# EasyEDA Pro project thedeck.epro

# Schematic FocusLight
Board Name: FocusLight; Create Date: 2026-03-29; Page Name: Sheet_1; Project Name: focusbox; Schematic Name: FocusLight; Update Date: 2026-04-11; Add into BOM: yes; Company: Akshat Sharma; Convert to PCB: yes; Date: 2026-03-27; REV: 1.0; Sheet: 1/1; spicePre: .
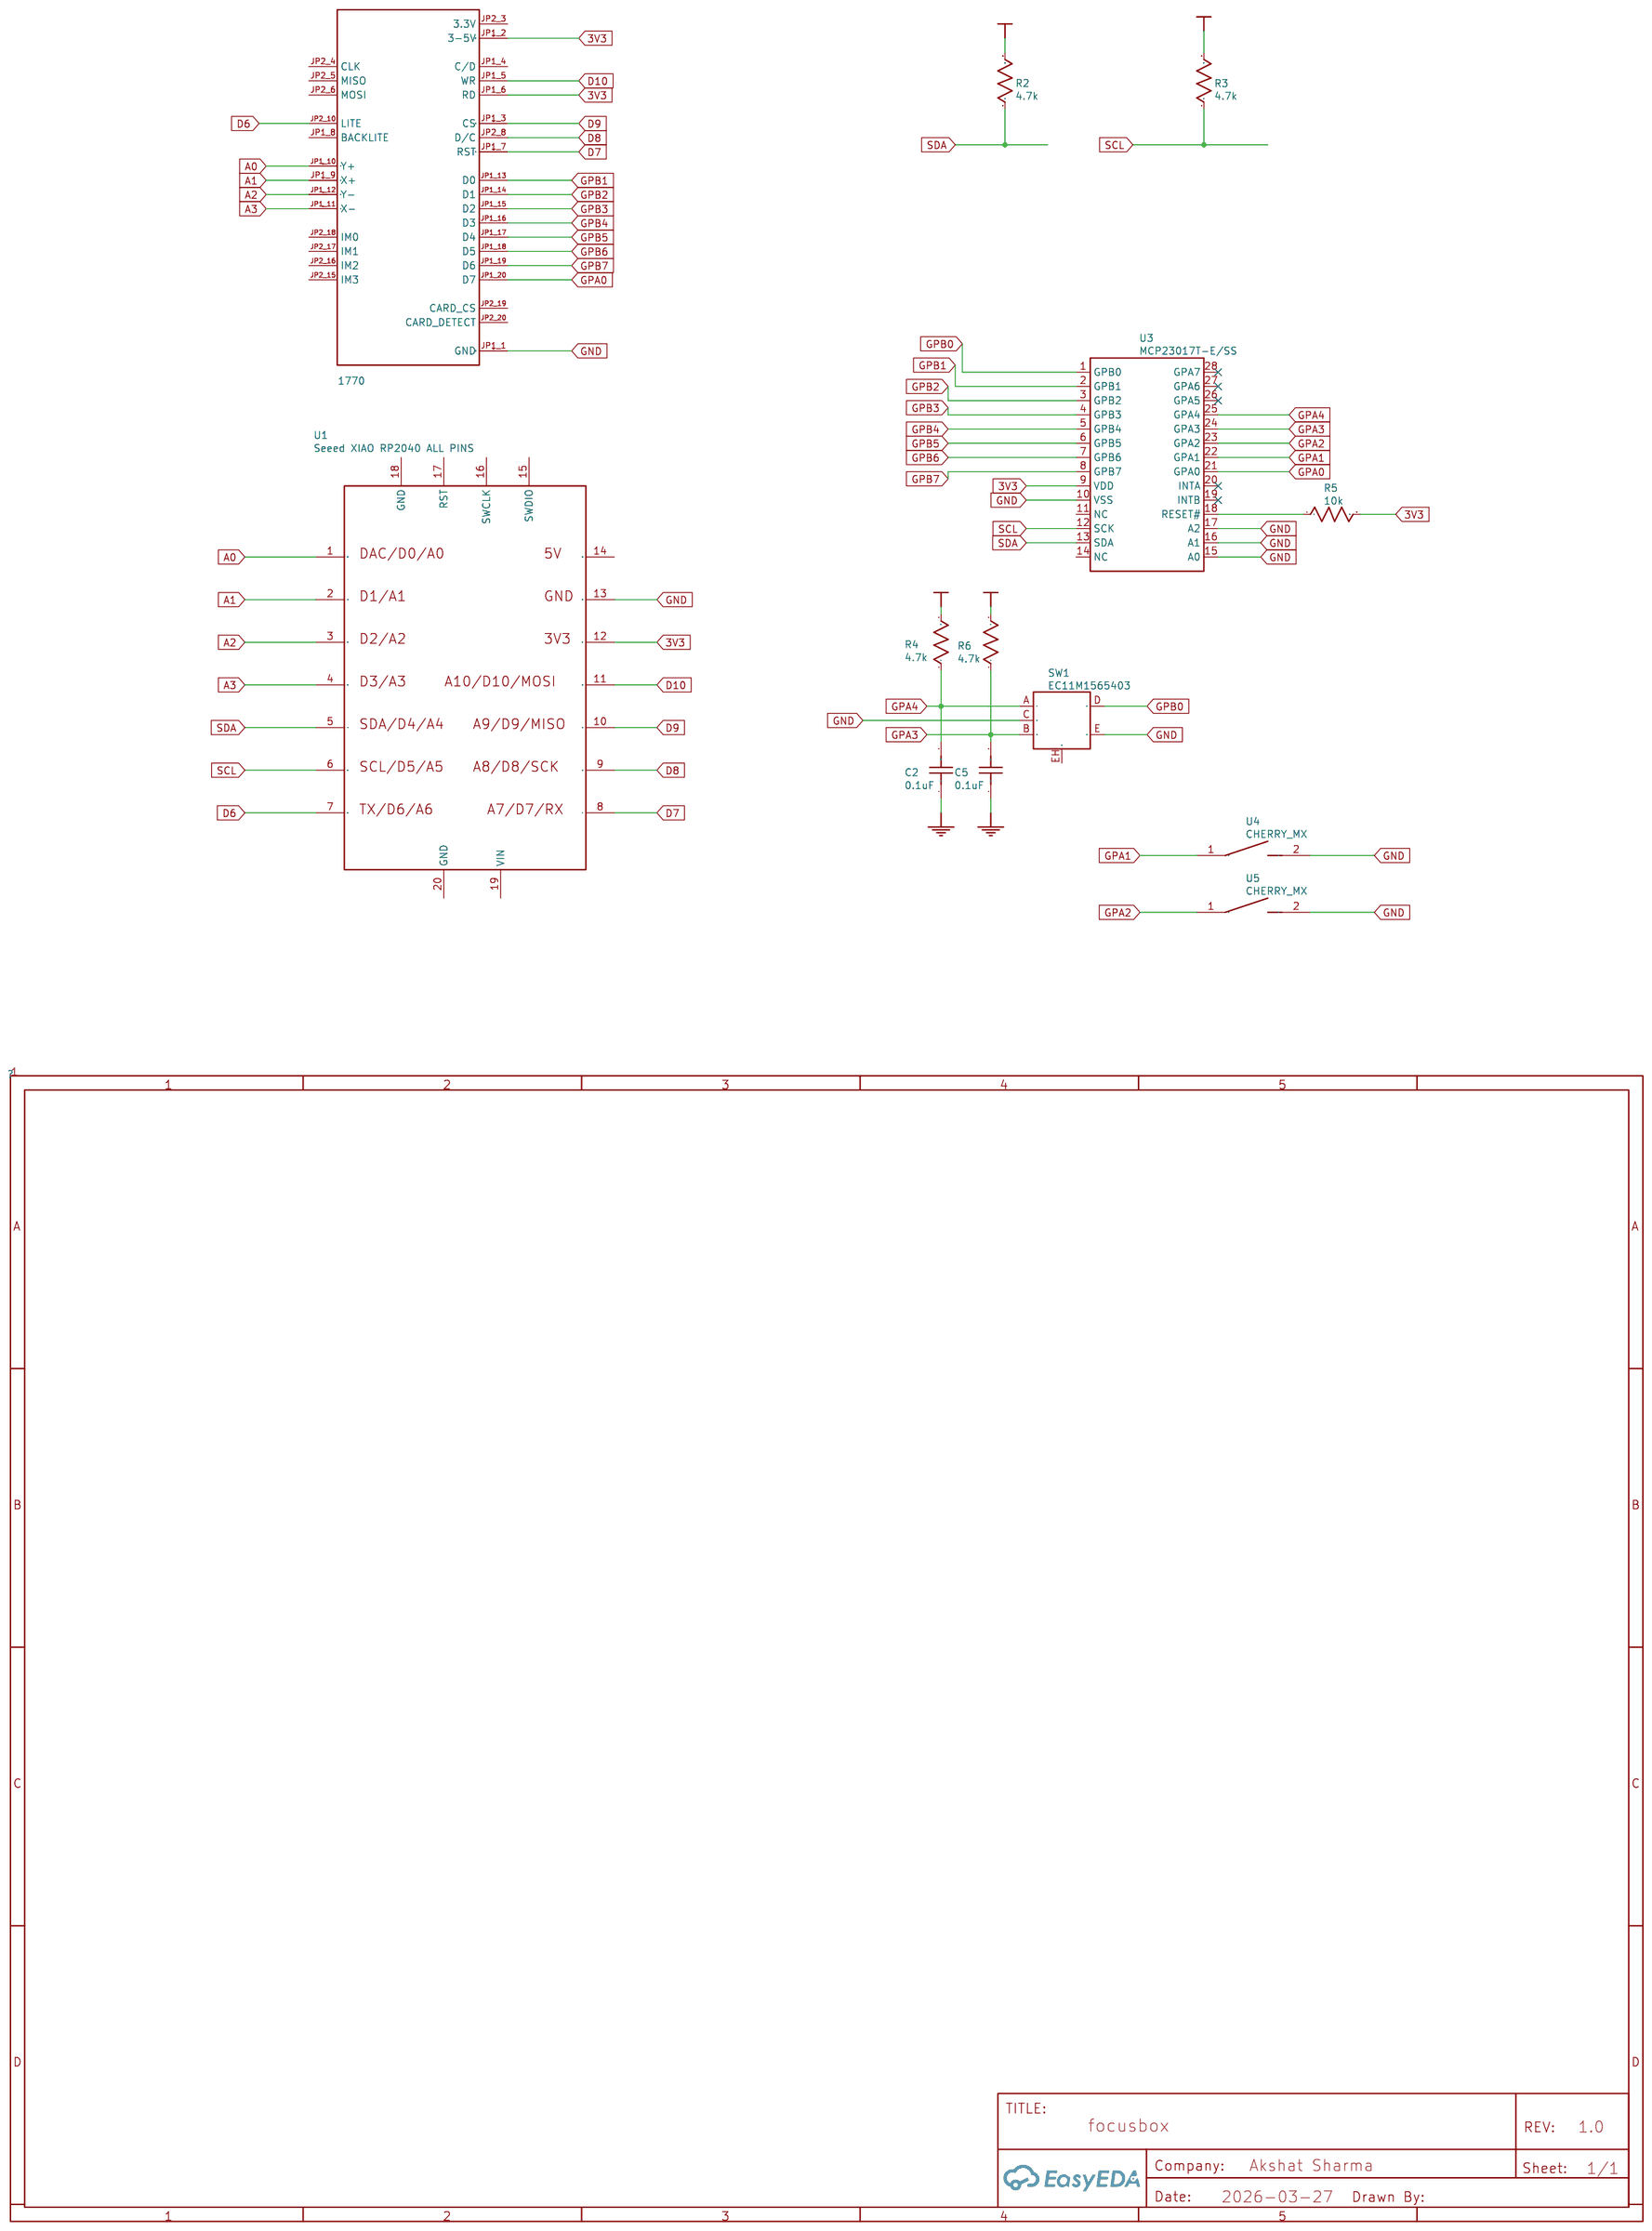
[diagram p0: schematic sheet]

## Parts
C2  0.1uF  [C0603]
C5  0.1uF  [C0603]
R2  4.7k  [R0603]
R3  4.7k  [R0603]
R4  4.7k  [R0603]
R5  10k  [R0603]
R6  4.7k  [R0603]
SW1  EC11M1565403  [SW-TH_EC11M1565403]
U1  Seeed XIAO RP2040 ALL PINS  [SEEED XIAO RP2040]
U3  MCP23017T-E/SS  [SSOP-28_L10.2-W5.3-P0.65-LS7.8-BL]
U4  CHERRY_MX  [CHERRY MX]
U5  CHERRY_MX  [CHERRY MX]
U7  1770  [MODULE_1770]

## Library data of the parts
C2 C5 = 0.1uF: nameAlias: Value(F); Contributor: LCEDA_Lib; spicePre: C; spiceSymbolName: C_0603_US
R2-R4 R6 = 4.7k: nameAlias: Value(Ω); Contributor: LCEDA_Lib; spicePre: R; spiceSymbolName: R_0603_US
R5 = 10k: nameAlias: Value(Ω); Contributor: LCEDA_Lib; spicePre: R; spiceSymbolName: R_0603_US
SW1 = EC11M1565403: Supplier: LCSC; Supplier Part: C470745; Manufacturer: ALPSALPINE(阿尔卑斯阿尔派); JLCPCB Part Class: Extended Part; Contributor: LCSC; spicePre: S
U1 = Seeed XIAO RP2040 ALL PINS: Manufacturer: Seeedstudio; Manufacturer Part: 102010328; link: https://www.seeedstudio.com/Seeeduino-XIAO-Arduino-Microcontroller-SAMD21-Cortex-M0+-p-4426.html; Contributor: Derick2k; spicePre: U
U3 = MCP23017T-E/SS: Supplier: LCSC; Supplier Part: C558584; Manufacturer: MICROCHIP(美国微芯); JLCPCB Part Class: Extended Part; Contributor: lcsc; spicePre: U
U4 U5 = CHERRY_MX: Manufacturer Part: CHERRY; Supplier: Reichelt; Contributor: drummdan; spicePre: U
U7 = 1770

## Nets
3V3: R2.2 R3.2 R4.2 R5.2 R6.2 U1.12(11) U3.9(VDD) U7.JP1_2(3-5V) U7.JP1_6(RD) U7.JP2_2(3-5V)
GND: C2.1 C5.1 SW1.C SW1.E U1.13(12) U3.10(VSS) U3.15(A0) U3.16(A1) U3.17(A2) U4.2 U5.2 U7.JP1_1(GND) U7.JP2_1(GND)
A0: U1.1(0) U7.JP1_10(Y+) U7.JP2_11(Y+)
A1: U1.2(1) U7.JP1_9(X+) U7.JP2_12(X+)
A2: U1.3(2) U7.JP1_12(Y-) U7.JP2_13(Y-)
A3: U1.4(3) U7.JP1_11(X-) U7.JP2_14(X-)
D6: U1.7(6) U7.JP2_10(LITE)
D7: U1.8(7) U7.JP1_7(RST) U7.JP2_9(RST)
D8: U1.9(8) U7.JP2_8(D/C)
D9: U1.10(9) U7.JP1_3(CS) U7.JP2_7(CS)
D10: U1.11(10) U7.JP1_5(WR)
GPA0: U3.21(GPA0) U7.JP1_20(D7)
GPA1: U3.22(GPA1) U4.1
GPA2: U3.23(GPA2) U5.1
GPA3: C5.2 R6.1 SW1.B U3.24(GPA3)
GPA4: C2.2 R4.1 SW1.A U3.25(GPA4)
GPB0: SW1.D U3.1(GPB0)
GPB1: U3.2(GPB1) U7.JP1_13(D0)
GPB2: U3.3(GPB2) U7.JP1_14(D1)
GPB3: U3.4(GPB3) U7.JP1_15(D2)
GPB4: U3.5(GPB4) U7.JP1_16(D3)
GPB5: U3.6(GPB5) U7.JP1_17(D4)
GPB6: U3.7(GPB6) U7.JP1_18(D5)
GPB7: U3.8(GPB7) U7.JP1_19(D6)
SCL: R3.1 U1.6(5) U3.12(SCK)
SDA: R2.1 U1.5(4) U3.13(SDA)
$1N56: R5.1 U3.18(RESET#)

Not connected (* = marked no-connect by the designer): SW1 EH; U1 14(13) 15(SWDIO) 16(SWCLK) 17(RST) 18(GND) 19(VIN) 20(GND); U3 11(NC) 14(NC) 19(INTB)* 20(INTA)* 26(GPA5)* 27(GPA6)* 28(GPA7)*; U7 JP1_4(C/D) JP1_8(BACKLITE) JP2_3(3.3V) JP2_4(CLK) JP2_5(MISO) JP2_6(MOSI) JP2_15(IM3) JP2_16(IM2) JP2_17(IM1) JP2_18(IM0) JP2_19(CARD_CS) JP2_20(CARD_DETECT)

# Board PCB_PCB_FocusLight_2026-03-29
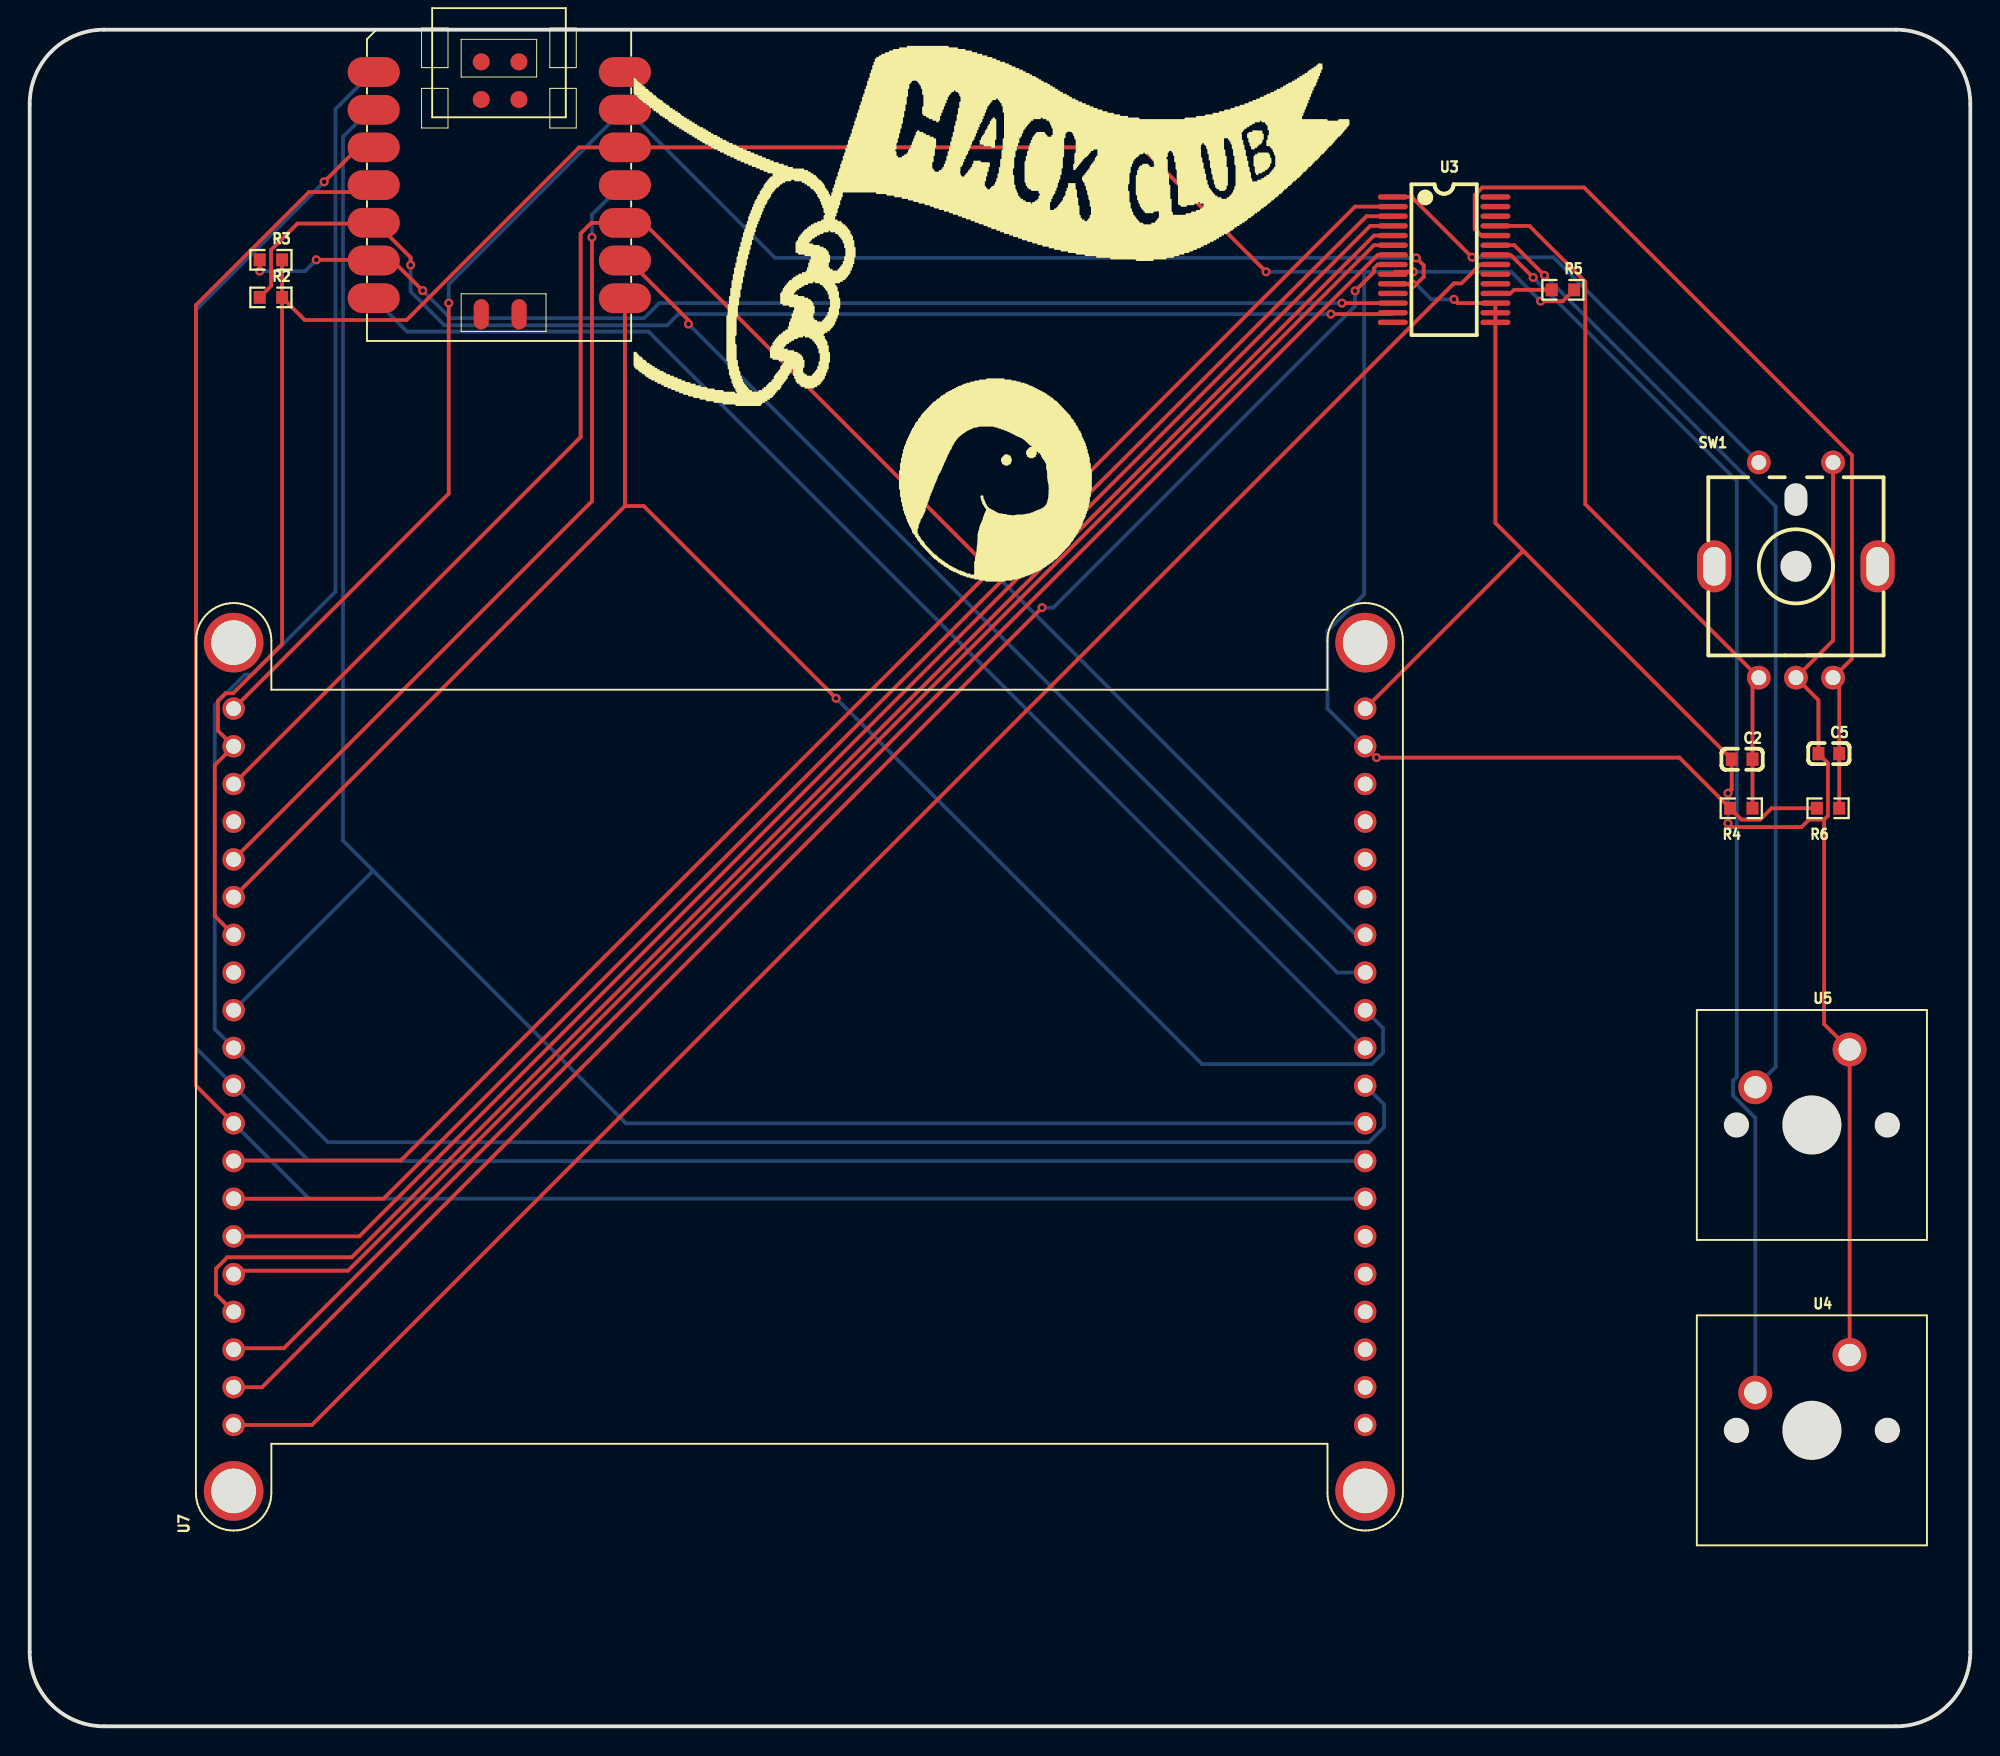
[diagram p1: board, top side]
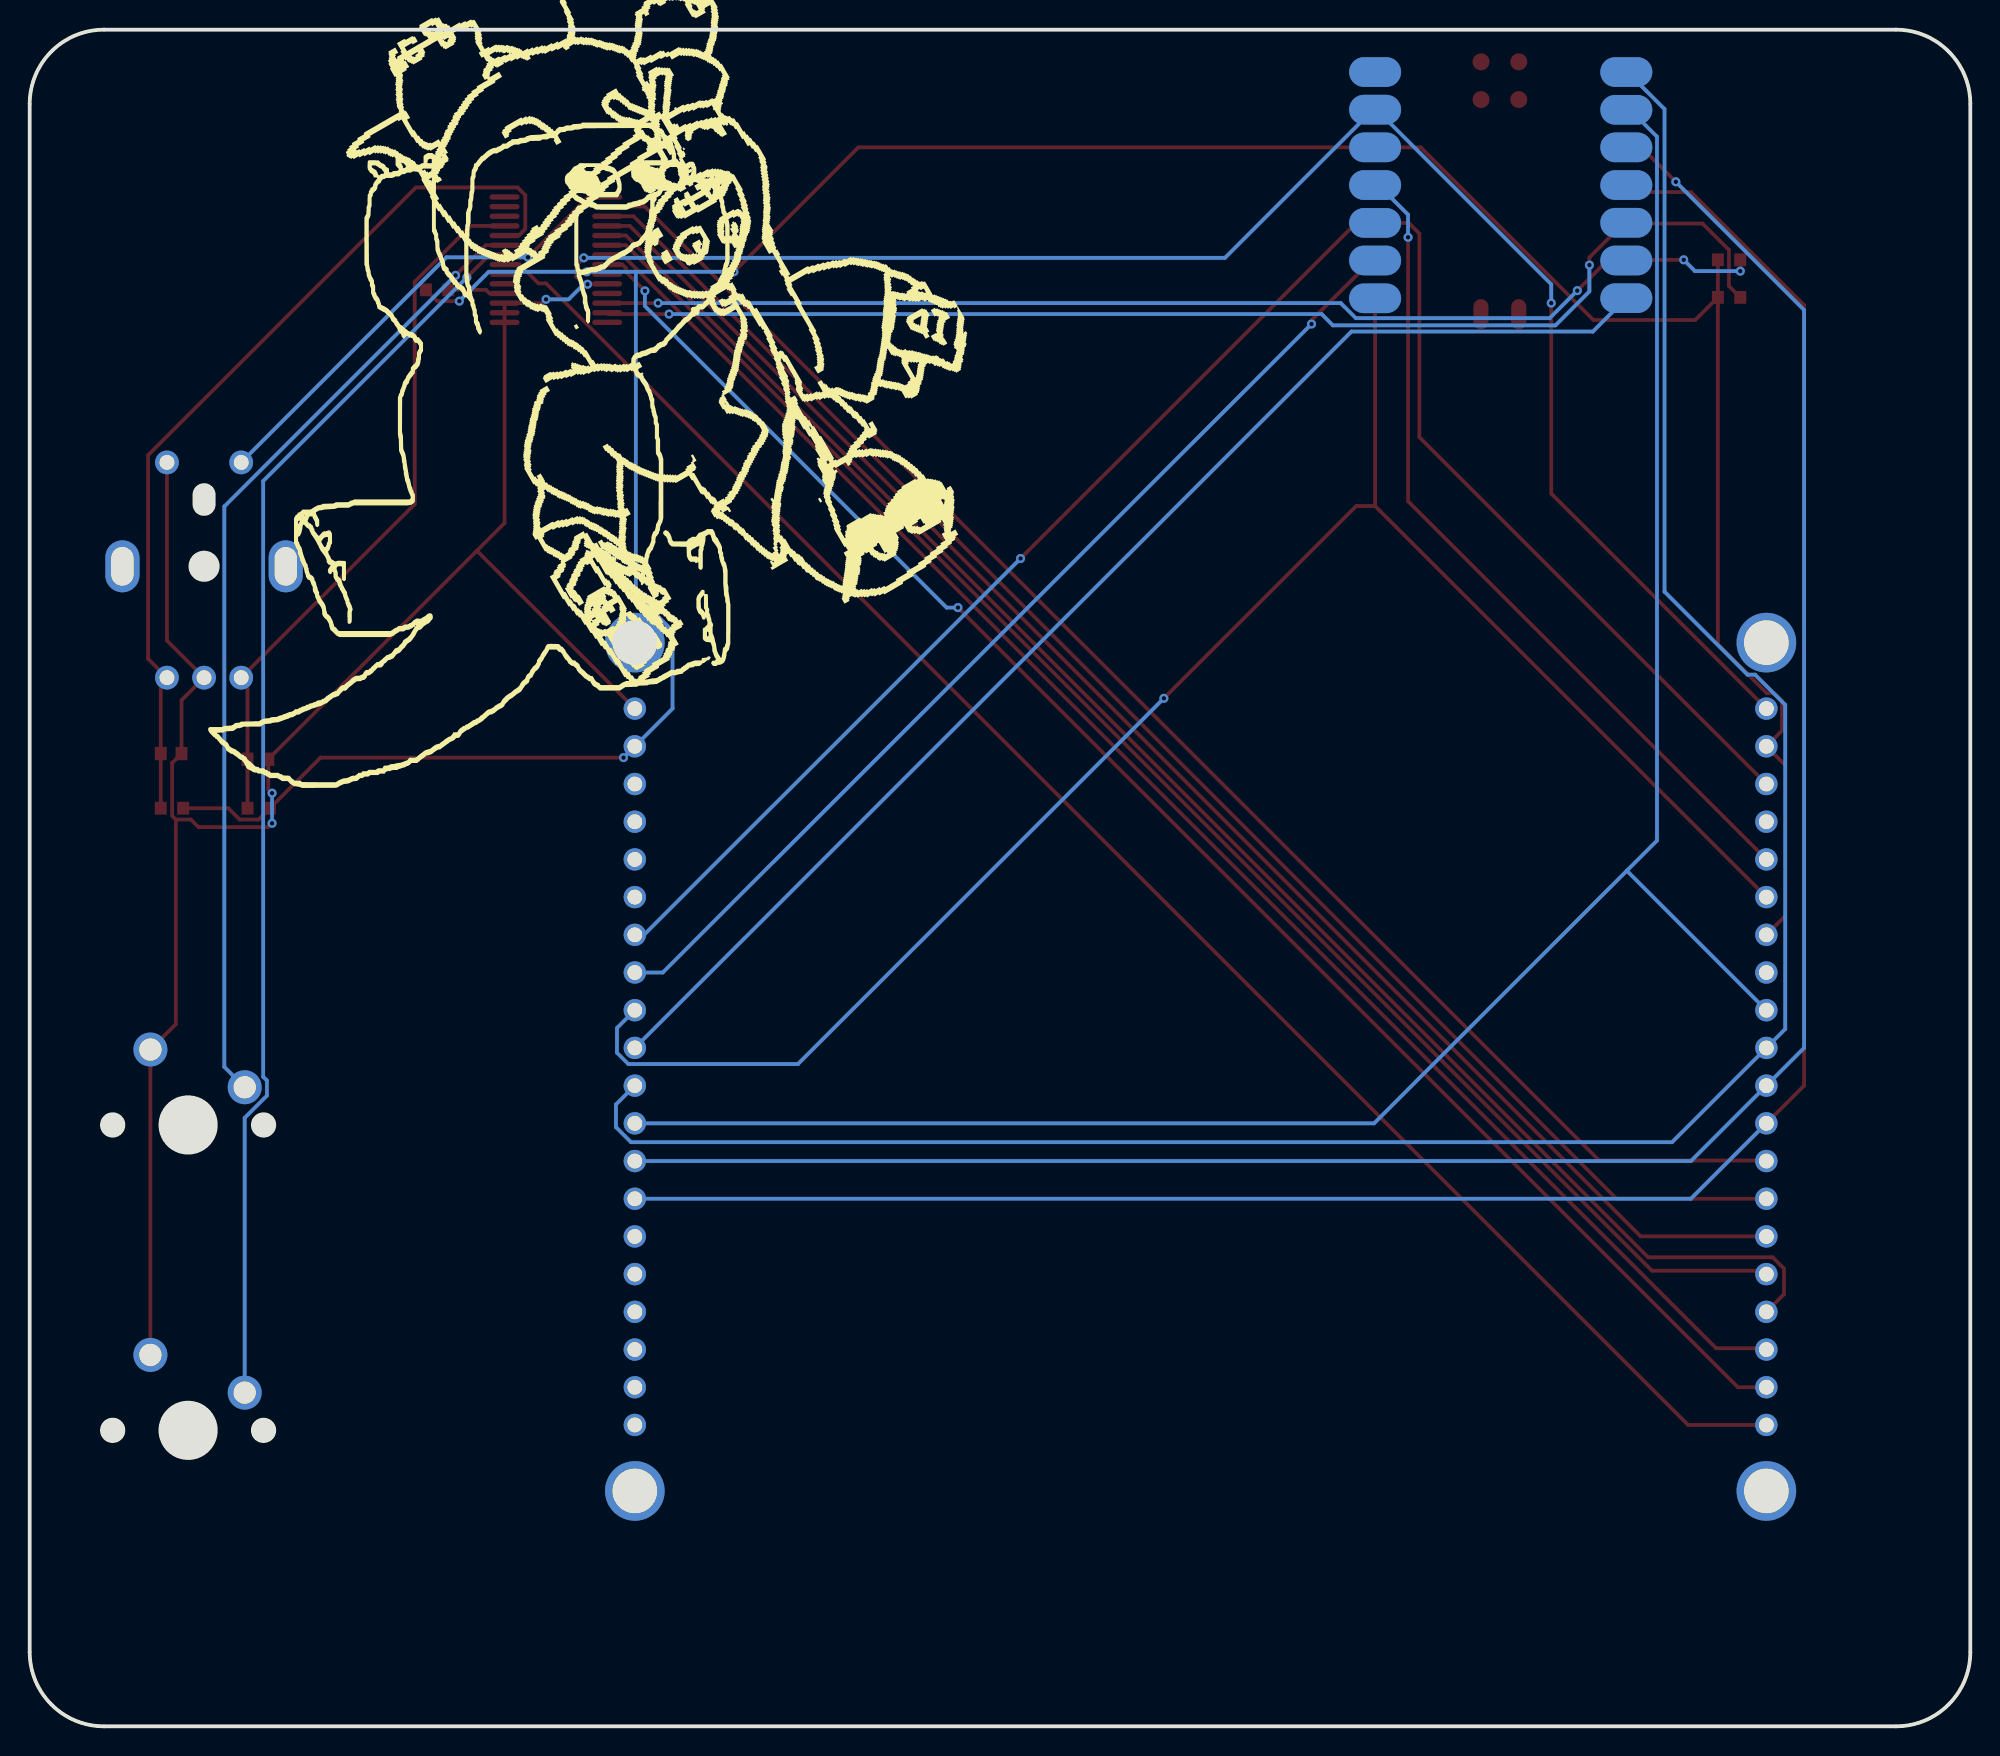
[diagram p2: board, bottom side, seen from below]

Outline 130.68 x 114.3 mm; copper layers: Top Layer, Bottom Layer. Coordinates in mm from the lower left corner of the outline.
Outline path: 0,109.3 arc(1.46,112.84) 5,114.3 125.68,114.3 arc(129.22,112.84) 130.68,109.3 130.68,5 arc(129.22,1.46) 125.68,0 5,0 arc(1.46,1.46) 0,5 0,109.3
Stack: Top Layer 0.035mm / Dielectric1 1.51mm FR4 er 4.5 / Bottom Layer 0.035mm

## Design rules (mm)
template: User Custom Config
spacing Default (default): track to track 0.152, other pairs 0 to 0.152
track width Default (default): min 0.254, default 0.254, max 25.4
differential pair differentialPair (default): width min 0.127, default 0.254, max 2.54; gap min 0.152, default 0.152
via Default (default): diameter min 0.61, default 0.61, max 100.025; hole min 0.305, default 0.305, max 59.995

## Placement (name value [footprint] x y rotation side)
C2  0.1uF  [C0603]  115.32 65.15 0 top
C5  0.1uF  [C0603]  121.16 65.53 0 top
R2  4.7k  [R0603]  16.24 96.27 0 top
R3  4.7k  [R0603]  16.24 98.8 0 top
R4  4.7k  [R0603]  115.26 61.85 180 top
R5  10k  [R0603]  103.25 96.77 0 top
R6  4.7k  [R0603]  121.1 61.85 180 top
SW1  EC11M1565403  [SW-TH_EC11M1565403]  118.94 77.9 0 top
U1  Seeed XIAO RP2040 ALL PINS  [SEEED XIAO RP2040]  31.62 103.63 0 top
U3  MCP23017T-E/SS  [SSOP-28_L10.2-W5.3-P0.65-LS7.8-BL]  95.25 98.81 270 top
U4  CHERRY_MX  [CHERRY MX]  120.02 19.94 0 top
U5  CHERRY_MX  [CHERRY MX]  120.02 40.51 0 top
U7  1770  [MODULE_1770]  51.83 44.43 90 top

## Footprints (pads in the part's own frame, mm; a bottom-side part is the same pattern mirrored in y, then rotated)
C0603
  rect 0.8x0.9 smd: 1(-0.7,0) 2(0.7,0)
CHERRY MX
  round 2.286 hole 1.498: 1(-3.81,2.54) 2(2.54,5.08)
MODULE_1770
  round 1.508 hole 1: JP1_1(24.13,38.1) JP1_2(21.59,38.1) JP1_3(19.05,38.1) JP1_4(16.51,38.1) JP1_5(13.97,38.1) JP1_6(8.89,38.1) JP1_7(11.43,38.1) JP1_8(6.35,38.1) JP1_9(3.81,38.1) JP1_10(1.27,38.1) JP1_11(-3.81,38.1) JP1_12(-1.27,38.1) JP1_13(-6.35,38.1) JP1_14(-8.89,38.1) JP1_15(-11.43,38.1) JP1_16(-16.51,38.1) JP1_17(-13.97,38.1) JP1_18(-19.05,38.1) JP1_19(-21.59,38.1) JP1_20(-24.13,38.1) JP2_1(24.13,-38.1) JP2_2(21.59,-38.1) JP2_3(19.05,-38.1) JP2_4(16.51,-38.1) JP2_5(13.97,-38.1) JP2_6(11.43,-38.1) JP2_7(8.89,-38.1) JP2_8(6.35,-38.1) JP2_9(3.81,-38.1) JP2_10(1.27,-38.1) JP2_11(-1.27,-38.1) JP2_12(-3.81,-38.1) JP2_13(-6.35,-38.1) JP2_14(-8.89,-38.1) JP2_15(-11.43,-38.1) JP2_16(-13.97,-38.1) JP2_17(-16.51,-38.1) JP2_18(-19.05,-38.1) JP2_19(-21.59,-38.1) JP2_20(-24.13,-38.1)
  round 4.016 hole 3: SH1(-28.575,38.1) SH2(28.575,38.1) SH3(-28.575,-38.1) SH4(28.575,-38.1)
R0603
  rect 0.806x0.864 smd: 1(-0.753,0) 2(0.753,0)
SEEED XIAO RP2040
  custom 3.499x1.999 hole 1.199: 1(-8.458,7.816) 8(8.458,-7.43) 9(8.458,-4.88) 10(8.458,-2.35) 11(8.458,0.2) 12(8.458,2.74) 13(8.458,5.28) 14(8.458,7.816)
  custom 3.5x1.999 hole 1.199: 2(-8.458,5.27) 3(-8.458,2.74) 4(-8.458,0.2) 5(-8.458,-2.34) 6(-8.458,-4.88) 7(-8.458,-7.42)
  oval 1.016x2.032 smd: 15(-1.216,-8.502) 16(1.335,-8.502)
  round 1.143 smd: 17(-1.216,8.502) 18(1.323,8.502) 19(-1.216,5.962) 20(1.323,5.962)
SSOP-28_L10.2-W5.3-P0.65-LS7.8-BL
  oval 0.364x2.015 smd: 1(-4.225,-3.455) 2(-3.575,-3.455) 3(-2.925,-3.455) 4(-2.275,-3.455) 5(-1.625,-3.455) 6(-0.975,-3.455) 7(-0.325,-3.455) 8(0.325,-3.455) 9(0.975,-3.455) 10(1.625,-3.455) 11(2.275,-3.455) 12(2.925,-3.455) 13(3.575,-3.455) 14(4.225,-3.455) 15(4.225,3.455) 16(3.575,3.455) 17(2.925,3.455) 18(2.275,3.455) 19(1.625,3.455) 20(0.975,3.455) 21(0.325,3.455) 22(-0.325,3.455) 23(-0.975,3.455) 24(-1.625,3.455) 25(-2.275,3.455) 26(-2.925,3.455) 27(-3.575,3.455) 28(-4.225,3.455)
SW-TH_EC11M1565403
  round 1.6 hole 1: A(-2.5,-7.25) B(2.5,-7.25) C(0,-7.25) D(-2.5,7.25) E(2.5,7.25)
  oval 2.3x3.5 hole 1.5x2.6: EH(-5.5,0.25) EH(5.5,0.25)

## Nets
As in the schematic.

Pads without a net: SW1 EH; U1 14 15 16 17 18 19 20; U3 11 14 19 20 26 27 28; U7 JP1_4 JP1_8 JP2_3 JP2_4 JP2_5 JP2_6 JP2_15 JP2_16 JP2_17 JP2_18 JP2_19 JP2_20 SH1 SH2 SH3 SH4

## Via types
v1: diameter 0.61, hole 0.305, Top Layer to Bottom Layer, 26 vias

## Routing (per net, layer and track width the routed paths; a pad name or vN(x,y) marks a point on that pad's centre or on a via; arc(x,y) is an arc through that point)
3V3: length 214.4
  Top Layer w0.254: R2.2 18.52,94.74 25.38,94.74 37.01,106.37 U1.12 74.88,106.37 v1(83.26,97.99) ; R2.2 17,72.9 13.7,69.6 13.19,69.6 12.68,69.09 12.68,67.07 13.73,66.02 12.46,64.75 12.46,54.59 13.73,53.32 ; R2.2 R3.2 ; R6.2 117.3,61.85 116.54,61.09 115.27,61.09 111.1,65.26 v1(90.7,65.26) ; v1(101.75,96.01) 103.24,96.01 R5.2 ; v1(93.17,97.99) 91.95,97.99 U3.9
  Bottom Layer w0.254: v1(83.26,97.99) 89.86,97.99 ; 89.86,97.99 89.86,76.26 87.39,73.79 87.39,68.56 U7.JP2_2 v1(90.7,65.26) ; 89.86,97.99 v1(93.17,97.99) 99.77,97.99 v1(101.75,96.01)
GND: length 245.2
  Top Layer w0.254: 100.65,79.12 100.49,79.12 U7.JP2_1 ; 100.65,79.12 C2.1 114.62,63.12 v1(114.36,62.86) ; 100.65,79.12 98.7,81.06 98.7,95.88 96.17,95.88 v1(95.91,96.13) ; U4.2 U5.2 120.84,47.31 120.84,61.09 ; 13.73,68.56 28.22,83.05 v1(28.22,95.88) ; 120.84,61.09 121.09,61.34 121.09,64.9 C5.1 120.46,69.13 SW1.C 121.44,73.15 SW1.E ; 120.84,61.09 119.82,61.09 119.32,60.58 114.62,60.58 v1(114.36,60.83) ; U3.10 91.83,97.15 v1(93.12,97.15) 93.37,97.15 93.88,97.66 93.88,98.42 v1(93.37,98.93)
  Bottom Layer w0.254: v1(93.37,98.93) 50.19,98.93 40.29,108.83 40.16,108.83 ; v1(114.36,62.86) v1(114.36,60.83) ; v1(28.22,95.88) 28.22,97.15 39.9,108.83 40.16,108.83 ; v1(93.12,97.15) 93.37,97.15 94.39,96.13 v1(95.91,96.13) ; 40.16,108.83 U1.13
A0: length 154.9
  Bottom Layer w0.254: U1.1 23.09,111.45 20.59,108.95 20.59,76.44 15,70.85 14.5,70.85 12.46,68.82 12.46,46.97 20.08,39.35 90.19,39.35 91.2,40.37 91.2,41.89 U7.JP2_11
A1: length 140.3
  Bottom Layer w0.254: U7.JP2_12 40.15,40.62 23.13,57.64 ; 23.13,57.64 13.73,48.24 ; 23.13,57.64 21.1,59.67 21.1,107.09 22.91,108.9 U1.2
A2: length 148.1
  Top Layer w0.254: U1.3 22.15,106.37 v1(19.83,104.05)
  Bottom Layer w0.254: v1(19.83,104.05) 11.19,95.42 11.19,45.7 18.81,38.08 U7.JP2_13
A3: length 149.8
  Top Layer w0.254: U1.4 22.69,103.36 18.81,103.36 11.19,95.74 11.19,43.16 13.73,40.62
  Bottom Layer w0.254: 13.73,40.62 18.81,35.54 U7.JP2_14
D6: length 87.7
  Bottom Layer w0.254: U7.JP2_10 41.67,93.96 25.42,93.96 U1.7
D7: length 121.6
  Top Layer w0.254: 13.73,55.86 40.08,82.21 ; 40.08,82.21 41.35,82.21 v1(54.3,69.26) ; 40.08,82.21 U1.8
  Bottom Layer w0.254: v1(54.3,69.26) 78.94,44.62 90.37,44.62 91.14,45.38 91.14,47.04 U7.JP2_9
D8: length 69.9
  Top Layer w0.254: U1.9 40.34,98.75 44.36,94.72 v1(44.36,94.47)
  Bottom Layer w0.254: U7.JP2_8 88.05,50.78 v1(44.36,94.47)
D9: length 119.8
  Top Layer w0.254: v1(63.96,78.68) 41.35,101.28 U1.10 37.82,101.28 37.1,100.57 37.1,86.85 13.73,63.48
  Bottom Layer w0.254: U7.JP2_7 89.31,53.32 v1(63.96,78.68)
D10: length 56.5
  Top Layer w0.254: v1(37.86,100.31) 37.86,82.53 13.73,58.4
  Bottom Layer w0.254: U1.11 40.05,103.87 39.9,103.87 37.86,101.84 v1(37.86,100.31)
GPA0: length 117.4
  Top Layer w0.254: 98.7,98.48 97.69,98.48 96.42,97.21 95.91,97.21 19,20.3 13.73,20.3
GPA1: length 84.7
  Top Layer w0.254: v1(101.25,97.61) 99.72,99.13 98.7,99.13
  Bottom Layer w0.254: U4.1 116.2,40.99 114.71,42.49 114.71,43.5 114.96,43.76 114.96,83.89 v1(101.25,97.61)
GPA2: length 65.9
  Top Layer w0.254: v1(102.01,97.75) 99.98,99.78 98.7,99.78
  Bottom Layer w0.254: U5.1 117.58,44.42 117.58,82.18 v1(102.01,97.75)
GPA3: length 61.4
  Top Layer w0.254: 121.86,61.85 C5.2 121.86,70.23 SW1.B 122.71,71.92 122.71,85.63 104.68,103.67 97.82,103.67 97.31,103.16 97.31,100.87 97.75,100.43 98.7,100.43
GPA4: length 48.1
  Top Layer w0.254: 116.02,61.85 C2.2 116.02,70.22 SW1.A 104.76,82.33 104.76,97.32 100.99,101.08 98.7,101.08
GPB0: length 32.1
  Top Layer w0.254: v1(97.13,98.97) 93.07,103.03 U3.1
  Bottom Layer w0.254: v1(97.13,98.97) 102.62,98.97 SW1.D
GPB1: length 104.7
  Top Layer w0.254: 13.73,38.08 13.77,38.12 24.99,38.12 89.26,102.38 U3.2
GPB2: length 105.5
  Top Layer w0.254: U3.3 90.02,101.73 23.83,35.54 13.73,35.54
GPB3: length 106.3
  Top Layer w0.254: 13.73,33 13.74,33.01 22.2,33.01 90.27,101.08 91.8,101.08
GPB4: length 111.5
  Top Layer w0.254: U3.5 90.53,100.43 21.69,31.6 13.31,31.6 12.55,30.83 12.55,29.11 13.73,27.92
GPB5: length 106.8
  Top Layer w0.254: U3.6 90.53,99.78 21.44,30.69 13.96,30.69 13.73,30.46
GPB6: length 108.6
  Top Layer w0.254: 13.73,25.38 13.82,25.47 17.12,25.47 90.78,99.13 U3.7
GPB7: length 110.1
  Top Layer w0.254: 13.73,22.84 15.65,22.84 v1(68.17,75.37) ; v1(89.26,96.7) 90.53,97.97 90.53,98.23 90.78,98.48 U3.8
  Bottom Layer w0.254: v1(89.26,96.7) 89.26,95.69 68.94,75.37 v1(68.17,75.37)
SCL: length 79.4
  Top Layer w0.254: v1(26.47,96.72) 24.44,98.75 U1.6 23.12,98.8 v1(19.3,98.8) ; R3.1 v1(15.49,98.03) ; v1(88.37,95.88) U3.12
  Bottom Layer w0.254: v1(26.47,96.72) 28.32,94.86 41.38,94.86 42.39,95.88 v1(88.37,95.88) ; v1(15.49,98.03) 18.54,98.03 v1(19.3,98.8)
SDA: length 84.4
  Top Layer w0.254: v1(25.65,98.44) 25.65,98.95 23.36,101.24 23.11,101.24 ; 23.11,101.24 U1.5 ; 23.11,101.24 18.03,101.24 16.25,99.46 16.25,97.03 R2.1 ; U3.13 91.71,95.14 v1(87.63,95.14)
  Bottom Layer w0.254: v1(25.65,98.44) 25.65,96.67 27.94,94.38 42.92,94.38 43.68,95.14 v1(87.63,95.14)
$1N56: length 3.9
  Top Layer w0.254: 98.7,96.53 98.72,96.52 99.7,96.52 99.96,96.77 R5.1
